# EasyEDA schematic schematic.json
TITLE: Sheet_1; REV: 1.0; Date: 2024-07-29; Sheet: 1/1; Drawn By: usedgenes; Company: Your Company
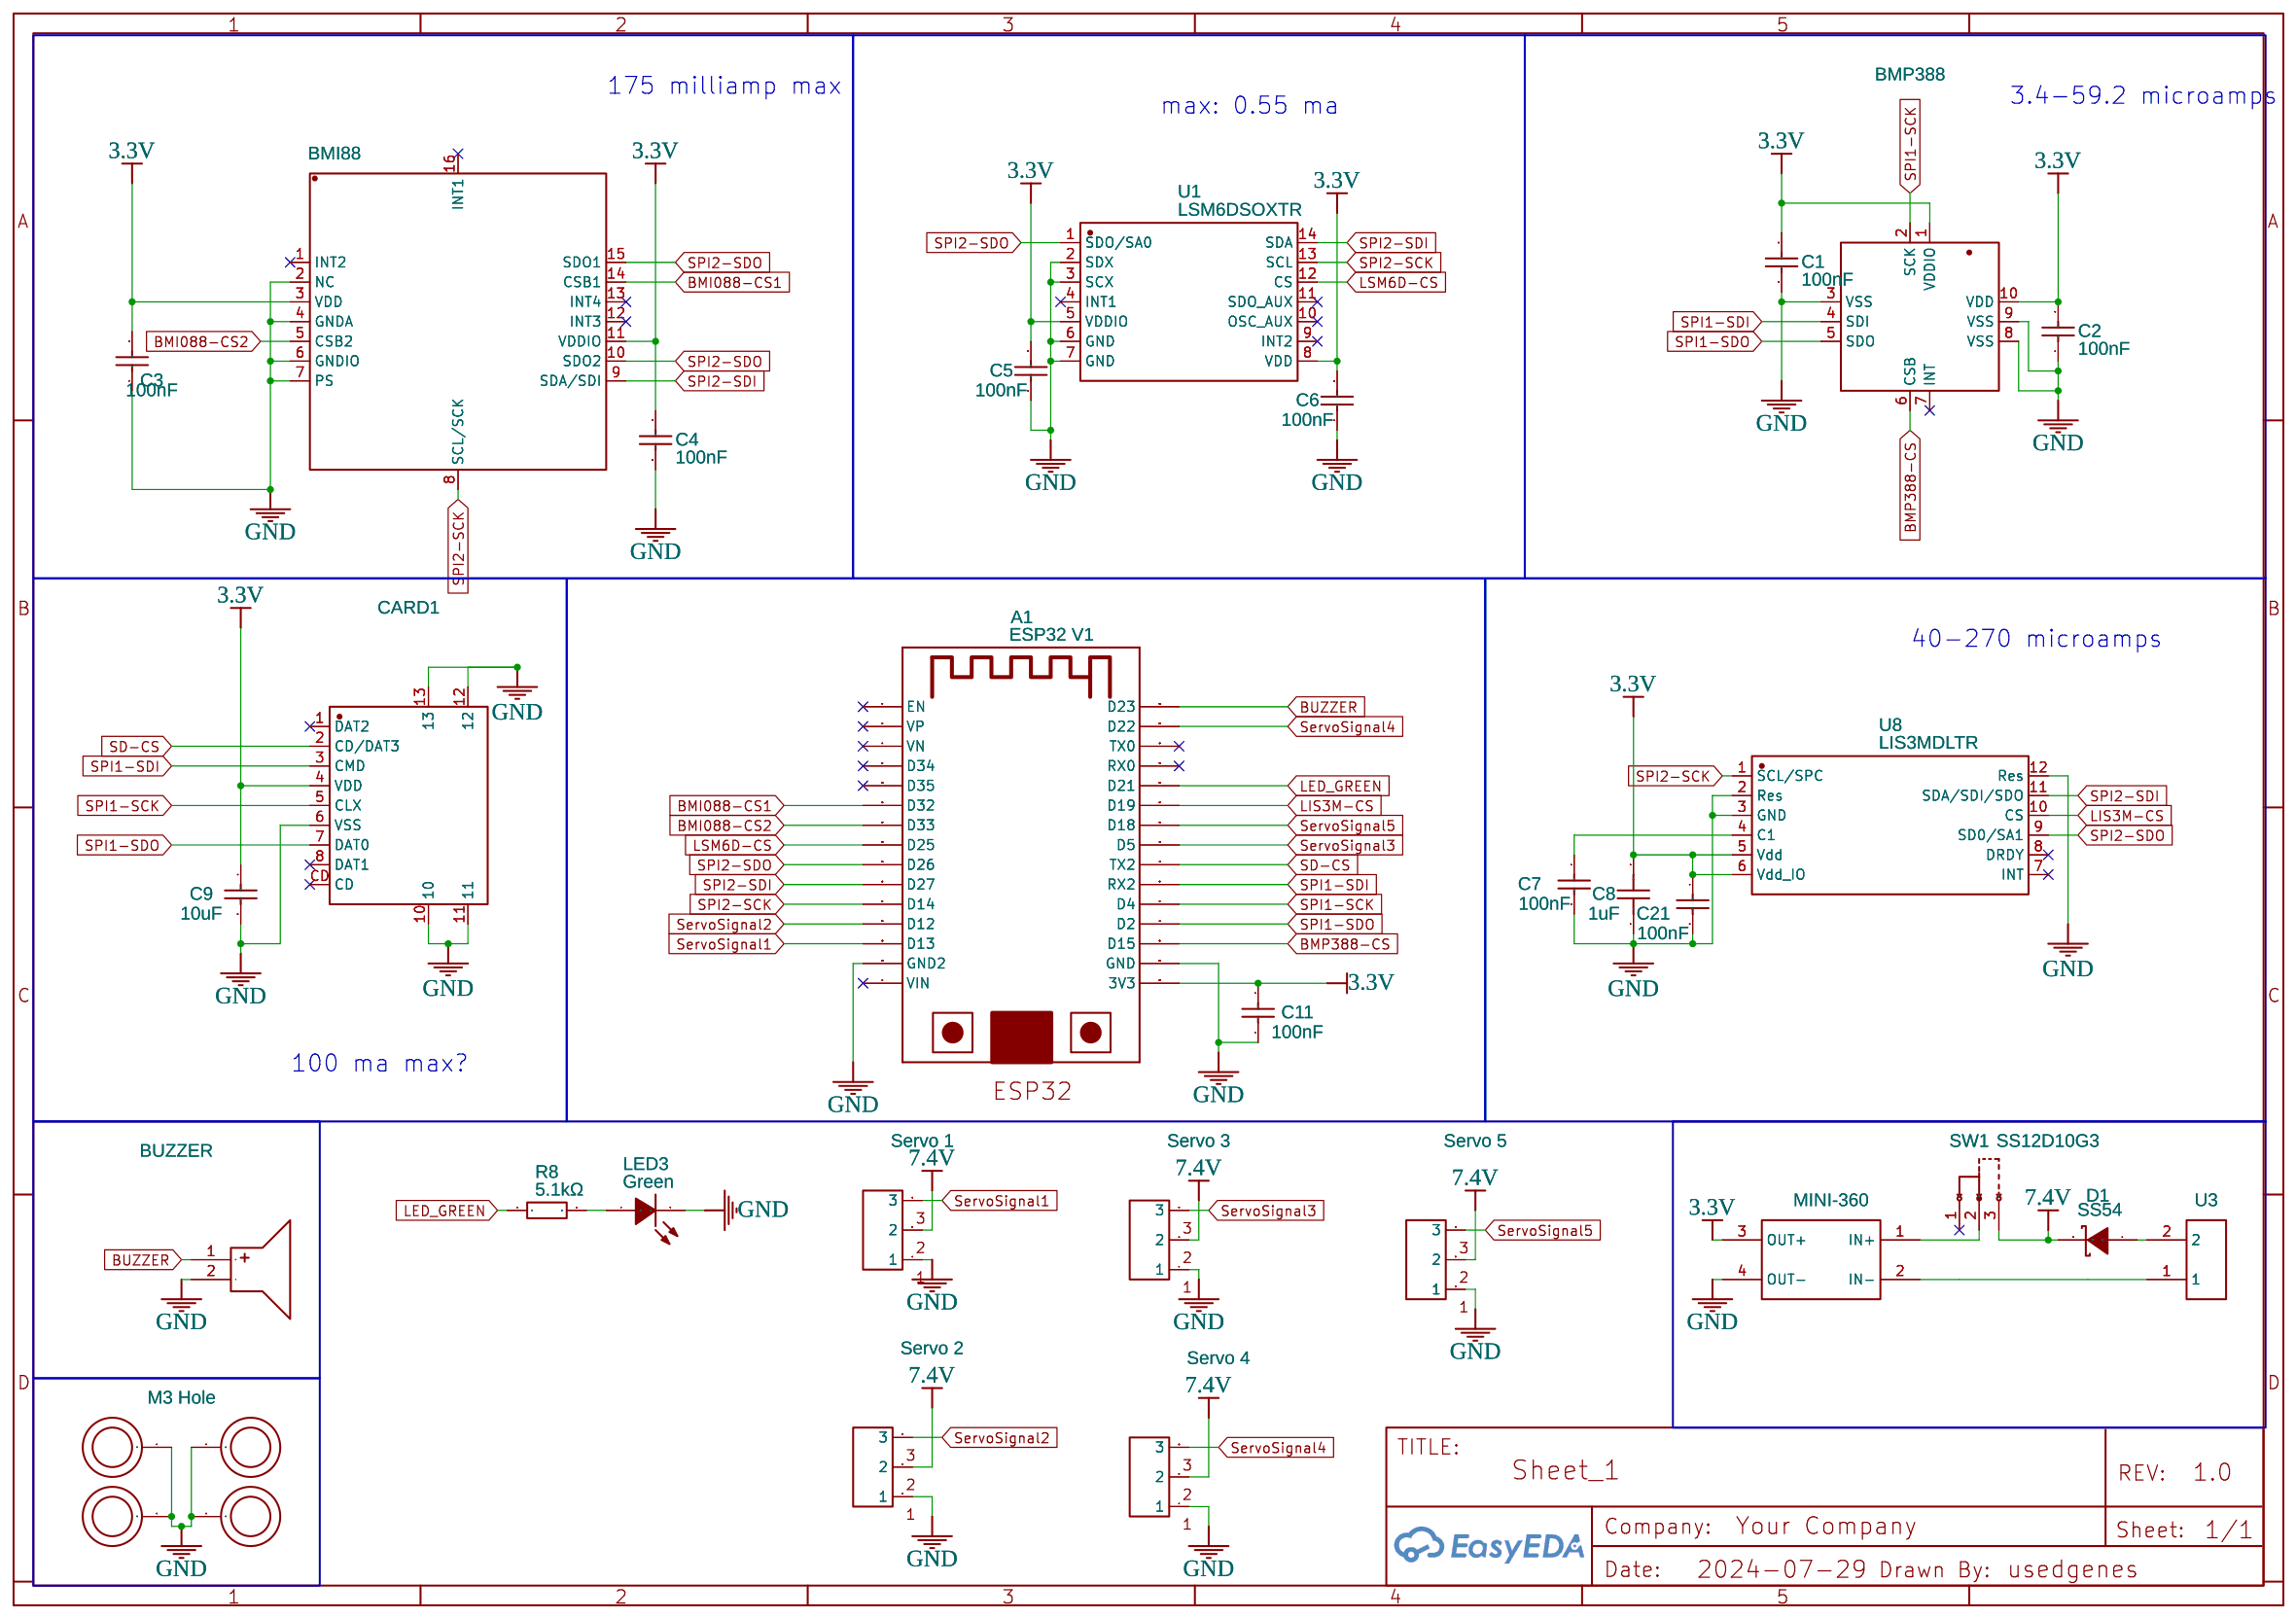
[diagram p0: schematic sheet]

## Parts
A1  ESP32 V1  [ESP32-DEVKITV1_ESP32-DEVKITV1]
BMI88  BMI088  [LGA-16_L4.5-W3.0-P0.50-BL]
BMP388  BMP388  [SENSORM-SMD_BMP388]
BUZZER  4000Hz  [BUZ-TH_BD14.0-P7.60-D1.0-L]
C1  100nF  [C0402]
C2  100nF  [C0402]
C3  100nF  [C0402]
C4  100nF  [C0402]
C5  100nF  [C0402]
C6  100nF  [C0402]
C7  100nF  [C0402]
C8  1uF  [C0402]
C9  10uF  [C0402]
C11  100nF  [C0402]
C21  100nF  [C0402]
CARD1  TF PUSH  [TF-SMD_TF-PUSH]
D1  SS54  [SMA_L4.4-W2.8-LS5.4-R-RD]
H1  M3 Hole  [HOLEHOLE]
H2  3MM_HOLE  [HOLEHOLE]
H3  3MM_HOLE  [HOLEHOLE]
H4  3MM_HOLE  [HOLEHOLE]
LED3  Green  [LED0805-R-RD]
MINI-360  MINI-360  [DSN-MINI-360]
P1  Servo 2  [CONNECTOR_PINHEADER_2.54MM:PINHEADER_1X3]
P2  Servo 1  [CONNECTOR_PINHEADER_2.54MM:PINHEADER_1X3]
P3  Servo 3  [CONNECTOR_PINHEADER_2.54MM:PINHEADER_1X3]
P4  Servo 5  [CONNECTOR_PINHEADER_2.54MM:PINHEADER_1X3]
P5  Servo 4  [CONNECTOR_PINHEADER_2.54MM:PINHEADER_1X3]
R8  5.1kΩ  [R0402]
SW1  SS12D10G3  [SW-TH_3P-P4.8-L12.7-W6.7_SS12D10G3]
U1  LSM6DSOXTR  [LGA-14L_L3.0-W2.5-P0.50-TL]
U3  Power Pins  [PIN HEADER CONNECTOR 1X2 PINS_PITCH 2.54MM]
U8  LIS3MDLTR  [LGA-12_L2.0-W2.0-P0.50-BL]

## Library data of the parts
A1 = ESP32-DEVKIT-V1-30PIN: Contributor: Ростислав Максимов
BMI88 = BMI088: Contributor: LCSC; Supplier: LCSC; Supplier Part: C194919; Manufacturer: Bosch(博世); JLCPCB Part Class: Extended Part
BMP388 = BMP388: Contributor: LCSC; Supplier: LCSC; Supplier Part: C779278; Manufacturer: Bosch(博世); JLCPCB Part Class: Extended Part
BUZZER = SKY-1475-0540-45P7.6: Contributor: LCSC; Supplier: LCSC; Supplier Part: C511707; Manufacturer: S&S(海旭); JLCPCB Part Class: Extended Part
C1-C7 C11 C21 = CL05B104KO5NNNC: Supplier: LCSC; Manufacturer: SAMSUNG(三星); Supplier Part: C1525; JLCPCB Part Class: Basic Part
C8 = CL05A105KA5NQNC: Supplier: LCSC; Manufacturer: SAMSUNG(三星); Supplier Part: C52923; JLCPCB Part Class: Basic Part
C9 = CL05A106MQ5NUNC: Supplier: LCSC; Manufacturer: SAMSUNG(三星); Supplier Part: C15525; JLCPCB Part Class: Basic Part
CARD1 = TF PUSH: Contributor: LCSC; Supplier: LCSC; Supplier Part: C393941; Manufacturer: SHOU HAN(首韩); JLCPCB Part Class: Extended Part
D1 = SS54_C22452: Supplier: LCSC; Manufacturer: MDD(辰达半导体); Supplier Part: C22452; JLCPCB Part Class: Basic Part
H1-H4 = 3MM_HOLE: Contributor: Cillié Malan
LED3 = 0805G (Green): Supplier: LCSC; Manufacturer: KENTO; Manufacturer Part: KT-0805G; Supplier Part: C2297; JLCPCB Part Class: Basic Part
MINI-360 = MINI-360: Contributor: RaspAutomacao
P1-P5 = HEADER PAD 3X RMM COPY: Supplier: LCSC; Manufacturer: BOOMELE; Manufacturer Part: Female headerHDR1X8-2.54; Supplier Part: C27438; JLCPCB Part Class: Extended Part; Contributor: blackhassio; Package Display: No
R8 = 0402WGF5101TCE: Supplier: LCSC; Manufacturer: UNI-ROYAL(厚声); Supplier Part: C25905; JLCPCB Part Class: Basic Part
SW1 = SS12D10G3: Supplier: LCSC; Supplier Part: C7431053; Manufacturer: SHOU HAN(首韩); Contributor: lcsc
U1 = LSM6DSOXTR: Contributor: LCSC; Supplier: LCSC; Supplier Part: C481766; Manufacturer: ST(意法半导体); JLCPCB Part Class: Extended Part
U3 = 1X2: Contributor: Ramsha
U8 = LIS3MDLTR: Contributor: LCSC; Supplier: LCSC; Supplier Part: C478483; Manufacturer: ST(意法半导体); JLCPCB Part Class: Extended Part

## Nets
3.3V: A1.3V3 BMI88.3(VDD) BMI88.11(VDDIO) BMP388.1(VDDIO) BMP388.10(VDD) C1.2 C2.2 C3.2 C4.2 C5.2 C6.2 C8.2 C9.1 C11.2 C21.1 CARD1.4(VDD) MINI-360.3(OUT+) U1.5(VDDIO) U1.8(VDD) U8.5(Vdd) U8.6(Vdd_IO)
7.4V: D1.2(K) P1.2 P2.2 P3.2 P4.2 P5.2 SW1.3
GND: A1.GND A1.GND2 BMI88.2(NC) BMI88.4(GNDA) BMI88.6(GNDIO) BMI88.7(PS) BMP388.3(VSS) BMP388.8(VSS) BMP388.9(VSS) BUZZER.2(-) C1.1 C2.1 C3.1 C4.1 C5.1 C6.1 C7.2 C8.1 C9.2 C11.1 C21.2 CARD1.6(VSS) CARD1.10 CARD1.11 CARD1.12 CARD1.13 H1.1 H2.1 H3.1 H4.1 LED3.2(K) MINI-360.4(OUT-) P1.1 P2.1 P3.1 P4.1 P5.1 U1.2(SDX) U1.3(SCX) U1.6(GND) U1.7(GND) U8.2(Res) U8.3(GND) U8.12(Res)
BMI088-CS1: A1.D32 BMI88.14(CSB1)
BMI088-CS2: A1.D33 BMI88.5(CSB2)
BMP388-CS: A1.D15 BMP388.6(CSB)
BUZZER: A1.D23 BUZZER.1(+)
LED_GREEN: A1.D21 R8.1
LIS3M-CS: A1.D19 U8.10(CS)
LSM6D-CS: A1.D25 U1.12(CS)
SD-CS: A1.TX2 CARD1.2(CD/DAT3)
ServoSignal1: A1.D13 P2.3
ServoSignal2: A1.D12 P1.3
ServoSignal3: A1.D5 P3.3
ServoSignal4: A1.D22 P5.3
ServoSignal5: A1.D18 P4.3
SPI1-SCK: A1.D4 BMP388.2(SCK) CARD1.5(CLX)
SPI1-SDI: A1.RX2 BMP388.4(SDI) CARD1.3(CMD)
SPI1-SDO: A1.D2 BMP388.5(SDO) CARD1.7(DAT0)
SPI2-SCK: A1.D14 BMI88.8(SCL/SCK) U1.13(SCL) U8.1(SCL/SPC)
SPI2-SDI: A1.D27 BMI88.9(SDA/SDI) U1.14(SDA) U8.11(SDA/SDI/SDO)
SPI2-SDO: A1.D26 BMI88.10(SDO2) BMI88.15(SDO1) U1.1(SDO/SA0) U8.9(SD0/SA1)
Net-(C7-1): C7.1 U8.4(C1)
Net-(D1-1): D1.1(A) U3.2
Net-(LED3-1): LED3.1(A) R8.2
Net-(MINI-360-1): MINI-360.1(IN+) SW1.2
Net-(MINI-360-2): MINI-360.2(IN-) U3.1

Not connected (* = marked no-connect by the designer): A1 D34* D35* EN* RX0* TX0* VIN* VN* VP*; BMI88 1(INT2)* 12(INT3)* 13(INT4)* 16(INT1)*; BMP388 7(INT)*; CARD1 1(DAT2)* 8(DAT1)* CD*; SW1 1*; U1 4(INT1)* 9(INT2)* 10(OSC_AUX)* 11(SDO_AUX)*; U8 7(INT)* 8(DRDY)*

## Notes on the sheet
- 175 milliamp max
- 3.4-59.2 microamps
- max: 0.55 ma
- 40-270 microamps
- 100 ma max?
